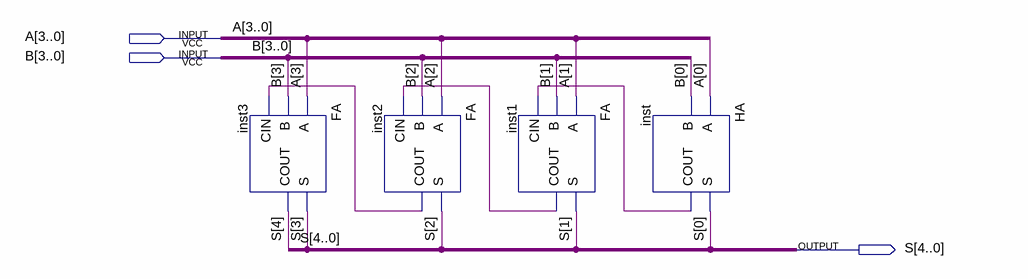
[diagram p0: schematic sheet]
// Quartus schematic CONG4BIT.bdf as structural Verilog: 4 symbols, 3 pins
module CONG4BIT (
  input  [3:0] A,
  input  [3:0] B,
  output [4:0] S
);

  wire inst1_cout, inst2_cout, inst_cout;

  FA inst3 (.A(A[3]), .B(B[3]), .CIN(inst2_cout), .S(S[3]), .COUT(S[4]));
  FA inst2 (.A(A[2]), .B(B[2]), .CIN(inst1_cout), .S(S[2]), .COUT(inst2_cout));
  FA inst1 (.A(A[1]), .B(B[1]), .CIN(inst_cout), .S(S[1]), .COUT(inst1_cout));
  HA inst (.A(A[0]), .B(B[0]), .S(S[0]), .COUT(inst_cout));
endmodule
